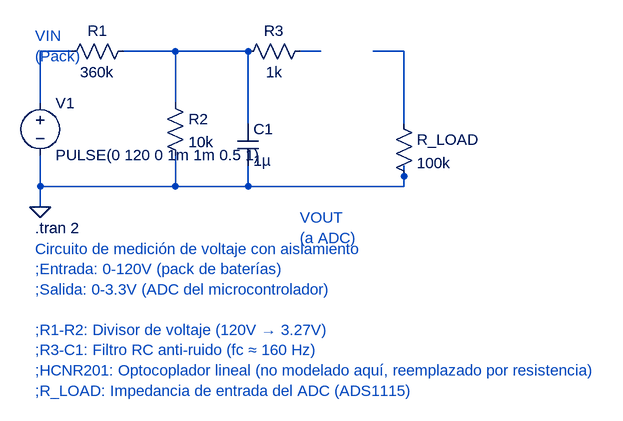
[diagram p0: schematic circuito_electronico.asc]
circuito_electronico.asc, the LTspice schematic file:
Version 4
SHEET 1 880 680
WIRE 96 64 48 64
WIRE 256 64 176 64
WIRE 368 64 256 64
WIRE 480 64 448 64
WIRE 608 64 560 64
WIRE 48 144 48 64
WIRE 256 144 256 64
WIRE 368 176 368 64
WIRE 608 176 608 64
WIRE 48 272 48 224
WIRE 256 272 256 224
WIRE 256 272 48 272
WIRE 368 272 368 240
WIRE 368 272 256 272
WIRE 608 272 608 240
WIRE 608 272 368 272
WIRE 48 304 48 272
FLAG 48 304 0
SYMBOL voltage 48 128 R0
WINDOW 123 0 0 Left 0
WINDOW 39 0 0 Left 0
SYMATTR InstName V1
SYMATTR Value PULSE(0 120 0 1m 1m 0.5 1)
SYMBOL res 192 48 R90
WINDOW 0 0 56 VBottom 2
WINDOW 3 32 56 VTop 2
SYMATTR InstName R1
SYMATTR Value 360k
SYMBOL res 240 128 R0
SYMATTR InstName R2
SYMATTR Value 10k
SYMBOL res 464 48 R90
WINDOW 0 0 56 VBottom 2
WINDOW 3 32 56 VTop 2
SYMATTR InstName R3
SYMATTR Value 1k
SYMBOL cap 352 176 R0
SYMATTR InstName C1
SYMATTR Value 1µ
SYMBOL res 592 160 R0
SYMATTR InstName R_LOAD
SYMATTR Value 100k
TEXT 40 336 Left 2 !.tran 2
TEXT 40 368 Left 2 ;Circuito de medición de voltaje con aislamiento\n;Entrada: 0-120V (pack de baterías)\n;Salida: 0-3.3V (ADC del microcontrolador)\n \n;R1-R2: Divisor de voltaje (120V → 3.27V)\n;R3-C1: Filtro RC anti-ruido (fc ≈ 160 Hz)\n;HCNR201: Optocoplador lineal (no modelado aquí, reemplazado por resistencia)\n;R_LOAD: Impedancia de entrada del ADC (ADS1115)
TEXT 448 320 Left 2 ;VOUT\n(a ADC)
TEXT 40 40 Left 2 ;VIN\n(Pack)

The netlist it stands for:
* circuito_electronico.asc
V1 N001 0 PULSE(0 120 0 1m 1m 0.5 1)
R1 N002 N001 360k
R2 N002 0 10k
R3 N003 N002 1k
C1 N002 0 1µ
R_LOAD N004 0 100k
.tran 2
* Circuito de medición de voltaje con aislamiento
* ;Entrada: 0-120V (pack de baterías)
* ;Salida: 0-3.3V (ADC del microcontrolador)
* ;R1-R2: Divisor de voltaje (120V → 3.27V)
* ;R3-C1: Filtro RC anti-ruido (fc ≈ 160 Hz)
* ;HCNR201: Optocoplador lineal (no modelado aquí, reemplazado por resistencia)
* ;R_LOAD: Impedancia de entrada del ADC (ADS1115)
* VOUT
* (a ADC)
* VIN
* (Pack)
.backanno
.end